# Altium project LIFI_PowerSupply.PrjPcb
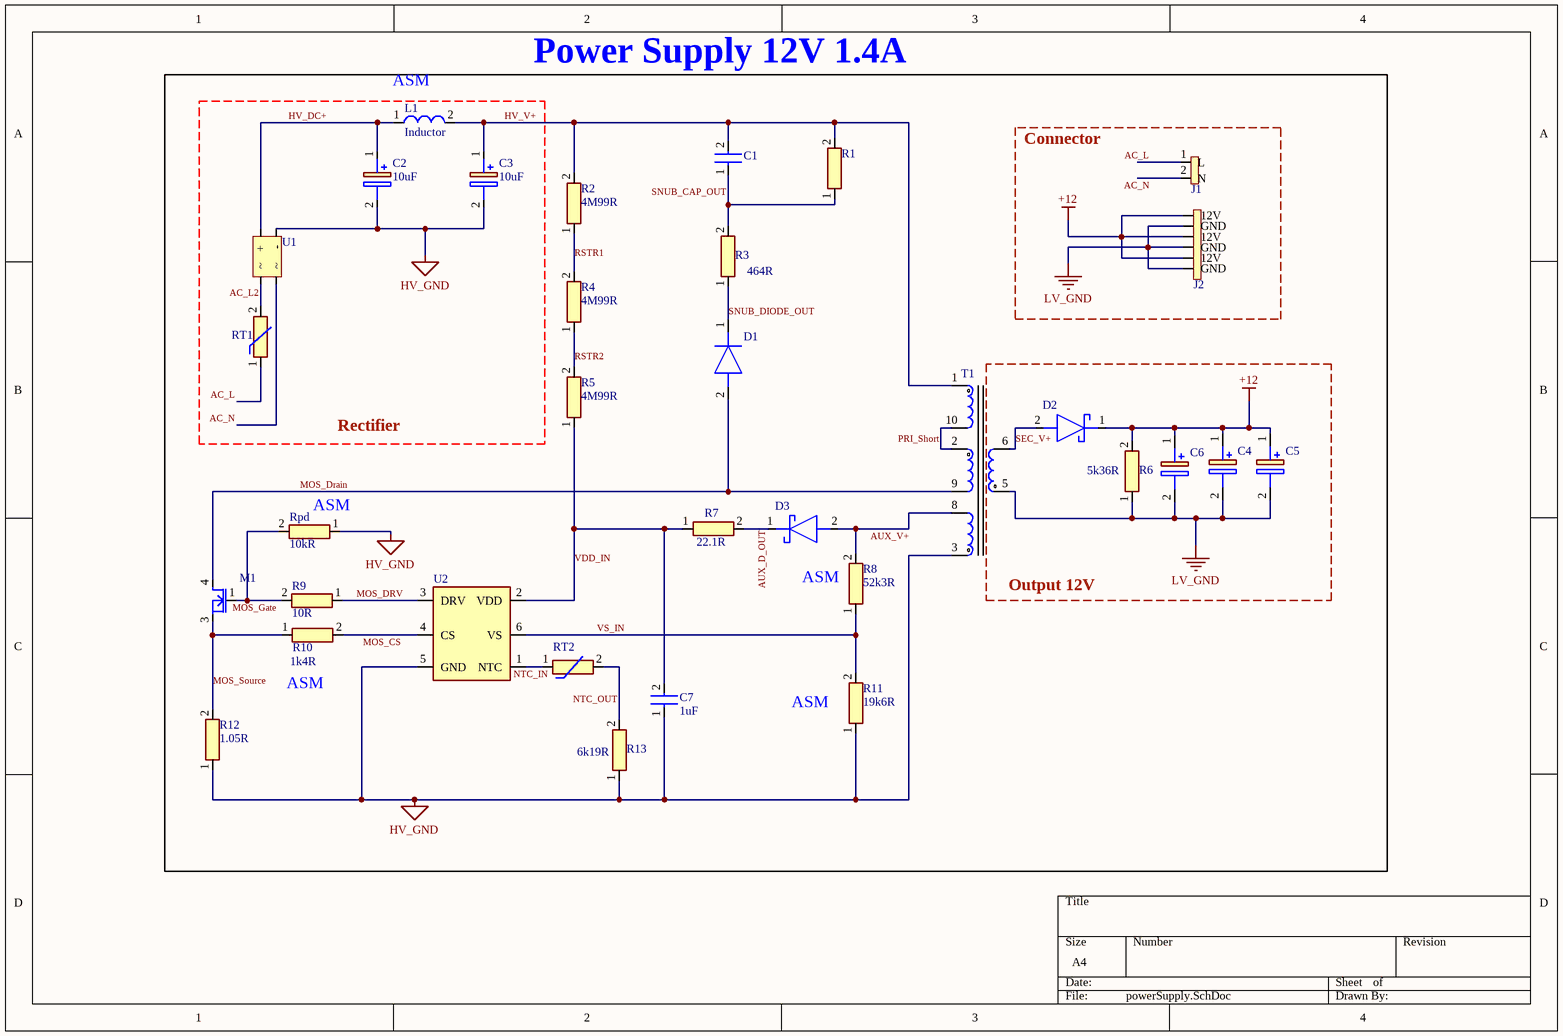
[diagram p0: powerSupply.SchDoc]
1 sheet, 33 parts. Net scope: global (net labels, ports and power ports of the same name join across sheets).
Board files: powerSupply.PcbDoc, powerSupply2.PcbDoc

## Sheet powerSupply.SchDoc
size A4; SheetNumber: 1; SheetTotal: 1

### Parts
C1  0805C  [0805C]  (value not drawn)
C2  10uF  [10uF]
C3  10uF  [10uF]
C4  16SVPG270MX  [Cout]  (value not drawn)
C5  16SVPG270MX  [Cout]  (value not drawn)
C6  16SVPG270MX  [Cout]  (value not drawn)
C7  1uF  [1206C]
D1  UFS180Je3_TR13  [UFS180Je3_TR13]  (value not drawn)
D2  RB058LAM100TR  [Shottky_Diode]  (value not drawn)
D3  RB058LAM100TR  [Shottky_Diode]  (value not drawn)
J1  AC(IN)  [AC(IN)]  (value not drawn)
J2  12V  [1x6P]  (value not drawn)
L1  Inductor  [INDP125125X600N]
M1  MOSFET  [MOSFET]  (value not drawn)
R1  3W-Resistor  [3W-Resistor]  (value not drawn)
R2  4M99R  [0805R]
R3  464R  [0402R]
R4  4M99R  [0805R]
R5  4M99R  [0805R]
R6  5k36R  [0402R]
R7  22.1R  [0402R]
R8  52k3R  [0603R]
R9  10R  [0805R]
R10  1k4R  [0402R]
R11  19k6R  [0603R]
R12  1.05R  [1206R]
R13  6k19R  [0402R]
Rpd  10kR  [0805R]
RT1  Cl-60  [CL-60]  (value not drawn)
RT2  NTCG104BF683JT1X  [NTC]  (value not drawn)
T1  750312495  [750312495]  (value not drawn)
U1  CD-MBL206SL  [CD-MBL210S_1]  (value not drawn)
U2  UCC28701DBVT  [SOT95P280X145-6N]  (value not drawn)

### Blocks framed on the sheet
Power Supply 12V 1.4A: C1-C3 C7 D1 D3 L1 M1 R1-R5 R7-R13 Rpd RT1 RT2 T1 U1 U2
Connector: J1 J2
Output 12V: C4-C6 D2 R6

### Nets
+12: C4.1(+) C5.1(+) C6.1(+) D2.1(K) J2.2(12V) J2.4(12V) J2.6(12V) R6.2
HV_GND: C2.2(-) C3.2(-) C7.1 R11.1 R12.1 R13.1 Rpd.1 T1.3 U1.4(-) U2.5(GND)
LV_GND: C4.2(-) C5.2(-) C6.2(-) J2.1(GND) J2.3(GND) J2.5(GND) R6.1 T1.5
AC_L: J1.1(L) RT1.1
AC_L2: RT1.2 U1.2
AC_N: J1.2(N) U1.3
AUX_D_OUT: D3.1(K) R7.2
AUX_V+: D3.2(A) R8.2 T1.8
HV_DC+: C2.1(+) L1.1 U1.1(+)
HV_V+: C1.2 C3.1(+) L1.2 R1.2 R2.2 T1.1
MOS_CS: R10.2 U2.4(CS)
MOS_Drain: D1.2(A) M1.4(D) T1.9
MOS_DRV: R9.1 U2.3(DRV)
MOS_Gate: M1.1(G) R9.2 Rpd.2
MOS_Source: M1.3(S) R10.1 R12.2
NTC_IN: RT2.1 U2.1(NTC)
NTC_OUT: R13.2 RT2.2
PRI_Short: T1.2 T1.10
RSTR1: R2.1 R4.2
RSTR2: R4.1 R5.2
SEC_V+: D2.2(A) T1.6
SNUB_CAP_OUT: C1.1 R1.1 R3.2
SNUB_DIODE_OUT: D1.1(K) R3.1
VDD_IN: C7.2 R5.1 R7.1 U2.2(VDD)
VS_IN: R8.1 R11.2 U2.6(VS)

### Notes on the sheet
- (near L1) ASM
- Rectifier
- (near Rpd) ASM
- (near R8) ASM
- (near R10) ASM
- (near R11) ASM

### Library data of the parts
C1 = 0805C: 10nF
C2 C3 = 10uF(Cin): Alum. Electrolytic Cap 10µF 400V 10mm Radial WCAP-AT1H; Lifetime 10000h +105°C; Manufacturer: Wurth Electronics; Manufacturer Part Number: 860241375002; Polarity: Polar; Ripple Current: 274mA; Life (Hours): 10000Hour; Tolerance: 20%; Supplier 1: Mouser; RoHS: Yes; Category: Aluminum Electrolytic Capacitors; Stock 1: 2312; Pricing 1: 1=0.88000, 10=0.87700, 50=0.74800, 100=0.65100, 1000=0.57900, 10000=0.57900 (USD); Mount: Through Hole; Case/Package: Radial; Min Operating Temperature: -25°C; Max Operating Temperature: 105°C; Package Quantity: 500; Packaging: Tape and Reel; Capacitance: 10uF; Voltage Rating: 400V; Voltage Rating (DC): 400V; Diameter: 10mm; Height: 16mm; Lead Pitch: 0.197inch; Height - Seated (Max): 0.688inch; REACH SVHC: Unknown; RoHS Compliant: Yes; ComponentLink1URL: http://www.farnell.com/datasheets/1958429.pdf?src-supplier=Farnell; ComponentLink1Description: http://www.farnell.com/datasheets/1958429.pdf?src-supplier=Farnell; ComponentLink2URL: http://katalog.we-online.de/pbs/datasheet/860241375002.pdf?src-supplier=Digi-Key; ComponentLink2Description: http://katalog.we-online.de/pbs/datasheet/860241375002.pdf?src-supplier=Digi-Key; ComponentLink3URL: http://www.farnell.com/datasheets/1958429.pdf?src-supplier=Element14; ComponentLink3Description: http://www.farnell.com/datasheets/1958429.pdf?src-supplier=Element14
C4-C6 = Cout: Capacitor Polarised; Manufacturer_Name: Panasonic; Datasheet Link: http://industrial.panasonic.com/cdbs/www-data/pdf/AAB8000/AAB8000C175.pdf; Height: 8mm; Manufacturer_Part_Number: 16SVPG270MX; Mouser Part Number: 667-16SVPG270MX; Mouser Price/Stock: https://www.mouser.co.uk/ProductDetail/Panasonic/16SVPG270MX?qs=XFmntM7Yc9fZM%2FbqBr2Fvw%3D%3D; Arrow Part Number: 16SVPG270MX; Arrow Price/Stock: https://www.arrow.com/en/products/16svpg270mx/panasonic?region=nac
C7 = 1206C: Cap Ceramic 1uF 100V X7R 10% SMD 1206 125°C Embossed T/R; Manufacturer: Kyocera AVX; Manufacturer Part Number: 12061C105KAT4A; Supplier 1: Mouser; RoHS: Yes; Category: Ceramic Capacitors; Stock 1: 79379; Pricing 1: 1=0.49000, 10=0.23600, 50=0.23600, 100=0.20300, 1000=0.12800, 10000=0.10400 (USD); Case/Package: 1206; Dielectric: X7R; Voltage Rating (DC): 100V; Capacitance: 1uF; Tolerance: 10%; RoHS Compliant: Yes; ComponentLink1URL: http://datasheets.avx.com/X7RDielectric.pdf?src-supplier=Digi-Key; ComponentLink1Description: http://datasheets.avx.com/X7RDielectric.pdf?src-supplier=Digi-Key
D1 = UFS180Je3_TR13: Diode; Manufacturer_Name: Microsemi Corporation; Manufacturer_Part_Number: UFS180Je3/TR13; Datasheet Link: https://media.digikey.com/pdf/Data%20Sheets/Microsemi%20PDFs/UFS160J-UFS180J.pdf; Height: 3.3mm; Mouser Part Number: 494-UFS180JE3/TR13; Mouser Price/Stock: https://www.mouser.co.uk/ProductDetail/Microchip-Microsemi/UFS180Je3-TR13?qs=pU29NIZ4ZwBQwIY5BrOkmA%3D%3D; Arrow Part Number: UFS180JE3/TR13; Arrow Price/Stock: https://www.arrow.com/en/products/ufs180je3tr13/microsemi
D2 D3 = Shottky_Diode: Schottky Diode; Manufacturer_Name: ROHM Semiconductor; Datasheet Link: https://fscdn.rohm.com/en/products/databook/datasheet/discrete/diode/schottky_barrier/rb058lam100tr-e.pdf; Height: 1.05mm; Manufacturer_Part_Number: RB058LAM100TR; Mouser Part Number: 755-RB058LAM100TR; Mouser Price/Stock: https://www.mouser.co.uk/ProductDetail/ROHM-Semiconductor/RB058LAM100TR?qs=HXFqYaX1Q2xzCgpEm4IcAg%3D%3D
J2 = Out(12V)
L1 = 470uH(L1): Inductor Power Shielded Wirewound 470uH 10% 1KHz 18Q-Factor Ferrite 0.18A 3.3Ohm DCR T/R; Manufacturer: Bourns; Manufacturer Part Number: SRR0604-471KL; Saturation Current: 220mA; Self Resonant Frequency: 6.5MHz; Q Factor: 18; Current Rating: 180mA; Current: 2.2A; DC Resistance (DCR): 3.3R; Supplier 1: Mouser; RoHS: Yes; Category: Fixed Inductors; Stock 1: 1611; Pricing 1: 1=0.93000, 10=0.67800, 50=0.67800, 100=0.62800, 1000=0.41200, 10000=0.38700 (USD); Mount: Surface Mount; Case/Package: Nonstandard; Core Material: Ferrite; Min Operating Temperature: -40°C; Max Operating Temperature: 125°C; Tolerance: 10%; Shielding: Shielded; Packaging: Tape and Reel; Package Quantity: 1000; Inductance: 470uH; Resistor Type: Wirewound; Test Frequency: 1kHz; Max DC Current: 180mA; Termination: SMD/SMT; DC Current: 180mA; Length: 6.5mm; Width: 6.5mm; Height: 4.8mm; Height - Seated (Max): 0.189inch; Depth: 6.7mm; Radiation Hardening: No; Military Standard: Not; ComponentLink1URL: https://datasheet.ciiva.com/29348/447222-da-01-en-induktivitaet-srr0604-471kl-470uh-0-22a-29348188.pdf?src-supplier=Conrad; ComponentLink1Description: https://datasheet.ciiva.com/29348/447222-da-01-en-induktivitaet-srr0604-471kl-470uh-0-22a-29348188.pdf?src-supplier=Conrad; ComponentLink2URL: https://datasheet.ciiva.com/6691/srr0604-6691703.pdf?src-supplier=Digi-Key; ComponentLink2Description: https://datasheet.ciiva.com/6691/srr0604-6691703.pdf?src-supplier=Digi-Key; ComponentLink3URL: https://datasheet.ciiva.com/6691/srr0604-6691705.pdf?src-supplier=Digi-Key; ComponentLink3Description: https://datasheet.ciiva.com/6691/srr0604-6691705.pdf?src-supplier=Digi-Key; ComponentLink4URL: https://datasheet.ciiva.com/6691/srr0604-6691708.pdf?src-supplier=Digi-Key; ComponentLink4Description: https://datasheet.ciiva.com/6691/srr0604-6691708.pdf?src-supplier=Digi-Key; ComponentLink5URL: https://datasheet.ciiva.com/8517/srr0604-8517198.pdf?src-supplier=Avnet; ComponentLink5Description: https://datasheet.ciiva.com/8517/srr0604-8517198.pdf?src-supplier=Avnet; ComponentLink6URL: https://datasheet.ciiva.com/31843/srr0604-31843470.pdf?src-supplier=Onlinecomponents.com; ComponentLink6Description: https://datasheet.ciiva.com/31843/srr0604-31843470.pdf?src-supplier=Onlinecomponents.com
M1 = MOSFET: Single N-Channel 800 V 900 mOhm 15 nC CoolMOS Power Mosfet - DPAK; Manufacturer: Infineon; Manufacturer Part Number: IPD80R900P7ATMA1; Max Dual Supply Voltage: 800V; Continuous Drain Current (ID): 6A; Rds On Max: 900mR; Input Capacitance: 350pF; Max Power Dissipation: 45W; Frequency: 16MHz; Frequency Stability: 0.15%; Frequency Tolerance: 0.5%; Capacitance: 15pF; Impedance: 40R; Supplier 1: Mouser; RoHS: Yes; Category: MOSFETs; Stock 1: 130; Pricing 1: 1=1.85000, 10=1.67000, 50=1.67000, 100=1.30000, 1000=0.94000, 10000=0.93900 (USD); Mount: Surface Mount; Case/Package: TO-252-3; Min Operating Temperature: -55°C; Max Operating Temperature: 150°C; Drain to Source Voltage (Vdss): 800V; Resistor Type: Ceramic; Packaging: Cut Tape; Lead Free: Contains Lead; Halogen Free: Halogen Free; RoHS Compliant: Yes; ComponentLink1URL: https://www.infineon.com/dgdl/Infineon-IPD80R900P7-DS-v02_00-EN.pdf?fileId=5546d4625b3ca4ec015b4287da753ee9&src-supplier=Digi-Key; ComponentLink1Description: https://www.infineon.com/dgdl/Infineon-IPD80R900P7-DS-v02_00-EN.pdf?fileId=5546d4625b3ca4ec015b4287da753ee9&src-supplier=Digi-Key
R1 = 3W-Resistor: Resistor; Manufacturer_Name: Vishay; Manufacturer_Part_Number: PR03000206202JAC00; Datasheet Link: https://www.vishay.com/docs/28729/pr010203.pdf; Mouser Part Number: 594-5093NW62K00J; Mouser Price/Stock: https://www.mouser.co.uk/ProductDetail/Vishay-BC-Components/PR03000206202JAC00?qs=LCMWAU1DZcxovZq7UzVsNA%3D%3D; Arrow Part Number: PR03000206202JAC00; Arrow Price/Stock: https://www.arrow.com/en/products/pr03000206202jac00/vishay
R2 R4 R5 R9 Rpd = 0805R
R3 R6 R7 R10 R13 = 0402R
R8 R11 = 0603R
  R11: LCSC Part No: C321774
R12 = 1206R
RT1 = Cl-60: CL Series 10 Ohm ± 25 % 5 A Radial Uninsulated Leads Thermistor Disc; Manufacturer: Amphenol; Supplier 1: Mouser; Manufacturer Part Number: CL-60; RoHS: No; Category: Uncategorized; Stock 1: 5231; Pricing 1: 1=2.16000, 10=1.95000, 50=1.95000, 100=1.33000, 1000=0.97800, 10000=0.85800 (USD); ComponentLink1URL: https://datasheet.ciiva.com/29855/aas-920-325d-thermometrics-ntc-inrush-031814-web-29855691.pdf?src-supplier=Digi-Key; ComponentLink1Description: https://datasheet.ciiva.com/29855/aas-920-325d-thermometrics-ntc-inrush-031814-web-29855691.pdf?src-supplier=Digi-Key; ComponentLink2URL: https://datasheet.ciiva.com/31455/629282-31455967.pdf?src-supplier=Element14; ComponentLink2Description: https://datasheet.ciiva.com/31455/629282-31455967.pdf?src-supplier=Element14; ComponentLink3URL: https://datasheet.ciiva.com/46652/70181314-46652413.pdf?src-supplier=Allied+Electronics; ComponentLink3Description: https://datasheet.ciiva.com/46652/70181314-46652413.pdf?src-supplier=Allied+Electronics
RT2 = NTC: Thermistor; Manufacturer_Name: TDK; Datasheet Link: https://product.tdk.com/system/files/dam/doc/product/sensor/ntc/chip-ntc-thermistor/catalog/tpd_commercial_ntc-thermistor_ntcg_en.pdf; Height: 0.55mm; Manufacturer_Part_Number: NTCG104BF683JT1X; Mouser Part Number: 810-NTCG104BF683JT; Mouser Price/Stock: https://www.mouser.com/Search/Refine.aspx?Keyword=810-NTCG104BF683JT
T1 = Transformer: Manufacturer_Name: Wurth Elektronik; Datasheet Link: https://www.we-online.com/catalog/datasheet/750312495.pdf; Height: 17.53mm; Manufacturer_Part_Number: 750312495; Mouser Part Number: 710-750312495; Mouser Price/Stock: https://www.mouser.co.uk/ProductDetail/Wurth-Elektronik/750312495?qs=qSfuJ%252Bfl%2Fd7M%2FwhZasVw9g%3D%3D
U1 = Bridge_Rectifier: DIO BR VRRM 600V 2A MBLS / Tape & Reel - 13" reel RoHS Compliant: Yes; Manufacturer: Bourns; Supplier 1: Mouser; Manufacturer Part Number: CD-MBL206SL; RoHS: Yes; Stock 1: 14176; Pricing 1: 1=0.45000, 10=0.39200, 50=0.39200, 100=0.29300, 1000=0.17800, 10000=0.13700 (USD); Mount: Surface Mount; Min Operating Temperature: -55°C; Max Operating Temperature: 175°C; Packaging: Cut Tape; Average Rectified Current: 2A; RoHS Compliant: Yes; ComponentLink1URL: http://www.farnell.com/datasheets/2176055.pdf?src-supplier=Farnell; ComponentLink1Description: http://www.farnell.com/datasheets/2176055.pdf?src-supplier=Farnell; ComponentLink2URL: http://www.farnell.com/datasheets/2176055.pdf?src-supplier=Element14; ComponentLink2Description: http://www.farnell.com/datasheets/2176055.pdf?src-supplier=Element14; ComponentLink3URL: https://www.bourns.com/docs/Product-Datasheets/cd-mbl2xxsl.pdf?src-supplier=Digi-Key; ComponentLink3Description: https://www.bourns.com/docs/Product-Datasheets/cd-mbl2xxsl.pdf?src-supplier=Digi-Key
U2 = Flyback_Controller: Integrated Circuit; Manufacturer_Name: Texas Instruments; Datasheet Link: http://www.ti.com/lit/gpn/ucc28701; Height: 1.45mm; Manufacturer_Part_Number: UCC28701DBVT; Mouser Part Number: 595-UCC28701DBVT; Mouser Price/Stock: https://www.mouser.co.uk/ProductDetail/Texas-Instruments/UCC28701DBVT?qs=rg6Iqu58vpU9cO7MIDHsMA%3D%3D; Arrow Part Number: UCC28701DBVT; Arrow Price/Stock: https://www.arrow.com/en/products/ucc28701dbvt/texas-instruments